# EAGLE design Ad8232_placa_V4 (EAGLE 9.6.2)
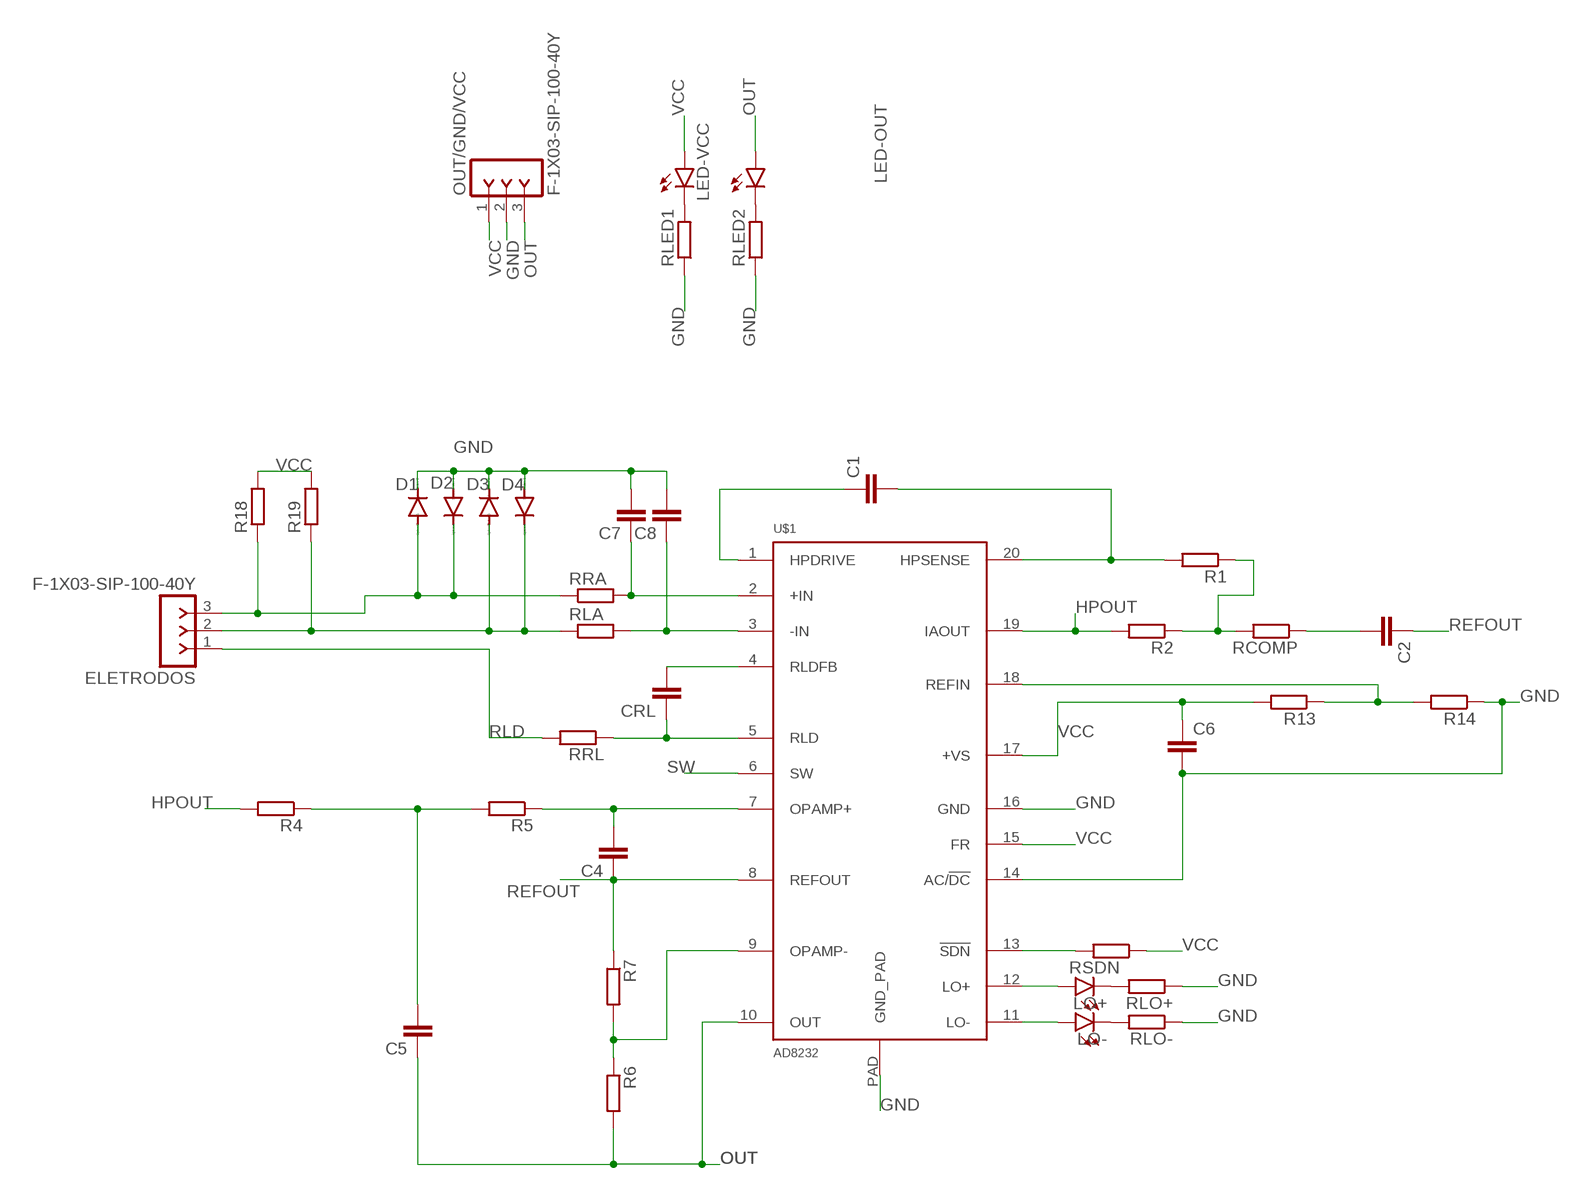
[diagram p0: schematic, sheet 1]

## Parts
C1  C-EUC0805  [C0805]
C2  C-EUC0805  [C0805]
C4  C-EUC0805  [C0805]
C5  C-EUC0805  [C0805]
C6  C-EUC0805  [C0805]
C7  C-EUC0805  [C0805]
C8  C-EUC0805  [C0805]
CRL  C-EUC0805  [C0805]
D1  DIODE-MINIMELF  [MINIMELF]
D2  DIODE-MINIMELF  [MINIMELF]
D3  DIODE-MINIMELF  [MINIMELF]
D4  DIODE-MINIMELF  [MINIMELF]
ELETRODOS  F-1X03-SIP-100-40Y  [SIP-100-03-40Y]
LED-OUT  LEDCHIPLED_0603  [CHIPLED_0603]
LED-VCC  LEDCHIPLED_0603  [CHIPLED_0603]
LO+  LEDCHIPLED_0603  [CHIPLED_0603]
LO-  LEDCHIPLED_0603  [CHIPLED_0603]
OUT/GND/VCC  F-1X03-SIP-100-40Y  [SIP-100-03-40Y]
R1  R-EU_R0805  [R0805]
R2  R-EU_R0805  [R0805]
R4  R-EU_R0805  [R0805]
R5  R-EU_R0805  [R0805]
R6  R-EU_R0805  [R0805]
R7  R-EU_R0805  [R0805]
R13  R-EU_R0805  [R0805]
R14  R-EU_R0805  [R0805]
R18  R-EU_R0805  [R0805]
R19  R-EU_R0805  [R0805]
RCOMP  R-EU_R0805  [R0805]
RLA  R-EU_R0805  [R0805]
RLED1  R-EU_R0805  [R0805]
RLED2  R-EU_R0805  [R0805]
RLO+  R-EU_R0805  [R0805]
RLO-  R-EU_R0805  [R0805]
RRA  R-EU_R0805  [R0805]
RRL  R-EU_R0805  [R0805]
RSDN  R-EU_R0805  [R0805]
U$1  AD8232  [LFCSP_20]

## Nets
GND: C6.2 C7.2 C8.2 D1.C D2.A D3.C D4.A OUT/GND/VCC.2 R14.1 RLED1.1 RLED2.1 RLO+.1 RLO-.1 U$1.14(AC/!DC) U$1.16(GND) U$1.PAD(GND_PAD)
HPOUT: R2.2 R4.2 U$1.19(IAOUT)
LO+: LO+.A U$1.12(LO+)
LO-: LO-.A U$1.11(LO-)
N$1: C1.1 U$1.1(HPDRIVE)
N$2: C1.2 R1.2 U$1.20(HPSENSE)
N$3: C7.1 RRA.2 U$1.2(+IN)
N$4: C8.1 RLA.2 U$1.3(-IN)
N$5: D1.A D2.C ELETRODOS.3 R18.1 RRA.1
N$6: D3.A D4.C ELETRODOS.2 R19.1 RLA.1
N$7: CRL.2 U$1.4(RLDFB)
N$8: CRL.1 RRL.1 U$1.5(RLD)
N$9: C4.2 R5.1 U$1.7(OPAMP+)
N$10: R13.1 R14.2 U$1.18(REFIN)
N$11: R6.1 R7.2 U$1.9(OPAMP-)
N$12: LED-OUT.C RLED2.2
N$13: R1.1 R2.1 RCOMP.2
N$14: C5.2 R4.1 R5.2
N$15: LED-VCC.C RLED1.2
N$16: RSDN.2 U$1.13(!SDN)
N$17: LO+.C RLO+.2
N$18: LO-.C RLO-.2
OUT: C5.1 LED-OUT.A OUT/GND/VCC.3 R6.2 U$1.10(OUT)
REFOUT: C2.1 C4.1 R7.1 U$1.8(REFOUT)
RLD: ELETRODOS.1 RRL.2
SW: C2.2 RCOMP.1 U$1.6(SW)
VCC: C6.1 LED-VCC.A OUT/GND/VCC.1 R13.2 R18.2 R19.2 RSDN.1 U$1.15(FR) U$1.17(+VS)

## Library data of the parts
C1 C2 C4-C8 CRL = rcl:C-EU: CAPACITOR, European symbol
D1-D4 = diode:DIODE-: DIODE
ELETRODOS OUT/GND/VCC = con-headers-jp:F-1X03-: FEMALE HEADER
LED-OUT LED-VCC LO+ LO- = led:LED: LED OSRAM: - CHIPLED LG R971, LG N971, LY N971, LG Q971, LY Q971, LO R971, LY R971 LH N974, LH R974 LS Q976, LO Q976, LY Q976 LO Q996 - Hyper CHIPLED LW Q18S LB Q993, LB Q99A, LB R99A - SideLED LS A670, LO A670, LY A670, LG A670, LP A670 LB A673, LV A673, LT A673, LW A673 LH A674 LY A675 LS A676, LA A676, LO A676, LY A676, LW A676 LS A679, LY A679, LG A679 - Hyper Micro SIDELED® LS Y876, LA Y876, LO Y876, LY Y876 LT Y87S - SmartLED LW L88C, LW L88S LB L89C, LB L89S, LG L890 LS L89K, LO L89K, LY L89K LS L896, LA L896, LO L896, LY L896 - TOPLED LS T670, LO T670, LY T670, LG T670, LP T670 LSG T670, LSP T670, LSY T670, LOP T670, LYG T670 LG T671, LOG T671, LSG T671 LB T673, LV T673, LT T673, LW T673 LH T674 LS T676, LA T676, LO T676, LY T676, LB T676, LH T676, LSB T676, LW T676 LB T67C, LV T67C, LT T67C, LS T67K, LO T67K, LY T67K, LW E67C LS E67B, LA E67B, LO E67B, LY E67B, LB E67C, LV E67C, LT E67C LW T67C LS T679, LY T679, LG T679 LS T770, LO T770, LY T770, LG T770, LP T770 LB T773, LV T773, LT T773, LW T773 LH T774 LS E675, LA E675, LY E675, LS T675 LS T776, LA T776, LO T776, LY T776, LB T776 LHGB T686 LT T68C, LB T68C - Hyper Mini TOPLED® LB M676 - Mini TOPLED Santana® LG M470 LS M47K, LO M47K, LY M47K Source: http://www.osram.convergy.de LUXEON: - LUMILED® LXK2-PW12-R00, LXK2-PW12-S00, LXK2-PW14-U00, LXK2-PW14-V00 LXK2-PM12-R00, LXK2-PM12-S00, LXK2-PM14-U00 LXK2-PE12-Q00, LXK2-PE12-R00, LXK2-PE12-S00, LXK2-PE14-T00, LXK2-PE14-U00 LXK2-PB12-K00, LXK2-PB12-L00, LXK2-PB12-M00, LXK2-PB14-N00, LXK2-PB14-P00, LXK2-PB14-Q00 LXK2-PR12-L00, LXK2-PR12-M00, LXK2-PR14-Q00, LXK2-PR14-R00 LXK2-PD12-Q00, LXK2-PD12-R00, LXK2-PD12-S00 LXK2-PH12-R00, LXK2-PH12-S00 LXK2-PL12-P00, LXK2-PL12-Q00, LXK2-PL12-R00 Source: www.luxeon.com KINGBRIGHT: KA-3528ASYC Source: www.kingbright.com
R1 R2 R4-R7 R13 R14 R18 R19 RCOMP RLA RLED1 RLED2 RLO+ RLO- RRA RRL RSDN = rcl:R-EU_: RESISTOR, European symbol
U$1 = AD8232:AD8232: Check prices <https://pricing.snapeda.com/parts/AD8232/Analog%20Devices/view-part?ref=eda>; AVAILABILITY: Not in stock; DESCRIPTION: AD8232 Sensor Signal Conditioner Interface Evaluation Board; MF: Analog Devices; MP: AD8232; PACKAGE: LFCSP-20 Analog Devices; PRICE: None

## Board
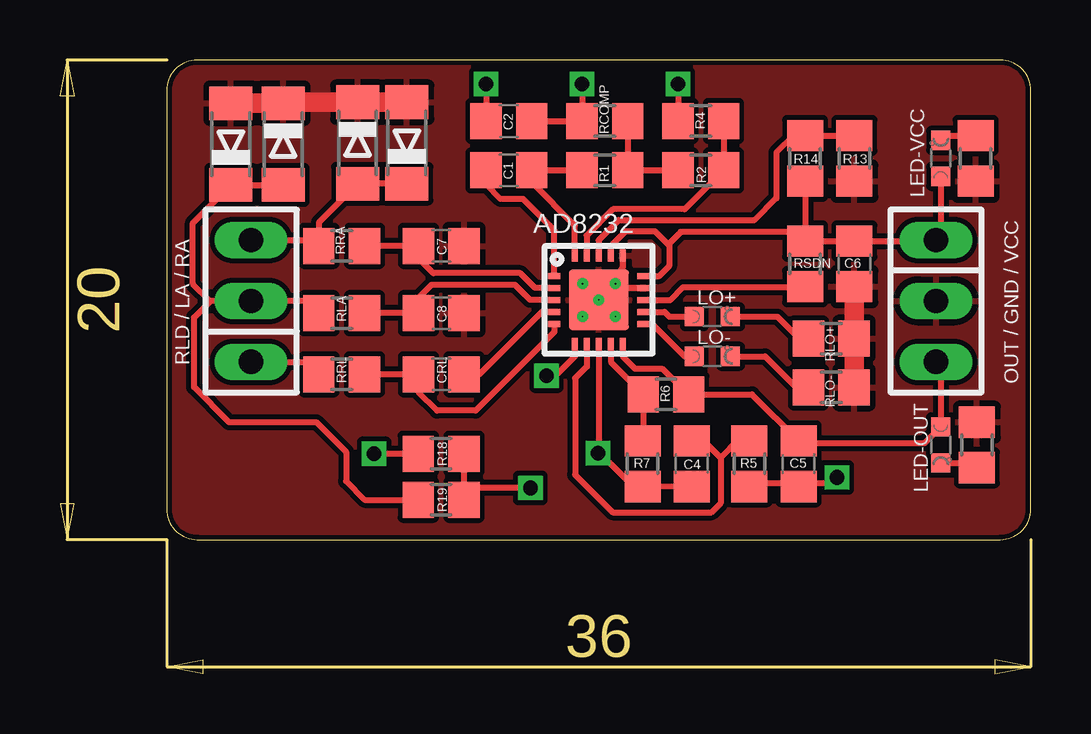
[diagram p1: board, top side]
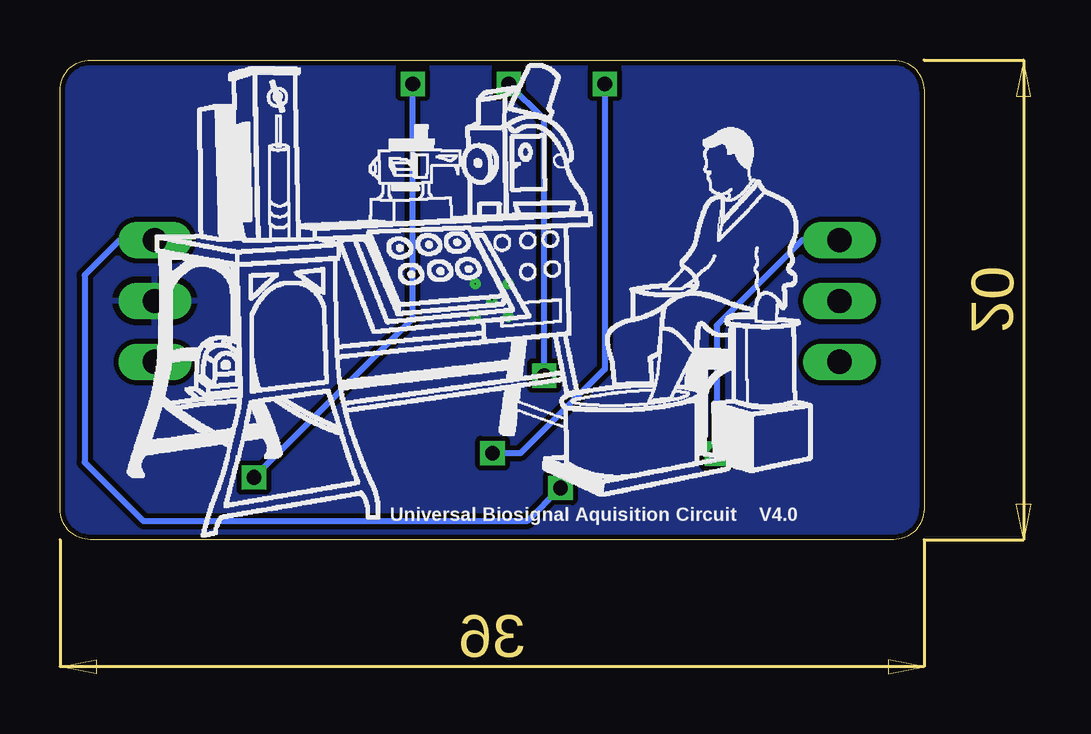
[diagram p2: board, bottom side, seen from below]

Size 36 x 20 mm. Coordinates in mm from the lower left corner, seen from the top.
Outline: 0,18.73 0,1.27 arc90 1.27,0 34.73,0 arc90 36,1.27 36,18.73 arc90 34.73,20 1.27,20 arc90 0,18.73
Copper layers (1*16): Top 0.035mm / dielectric 1.5mm / Bottom 0.035mm
Design rules "default *": minimum track width 10mil, minimum drill 24mil, track to track 8mil, track to pad 8mil, pad to pad 8mil, via to via 8mil, smd to smd 8mil, copper to edge 8mil, drill to drill 8mil, minimum pad ring 10mil, minimum via ring 8mil, stop-mask expansion 4mil, vias tented up to drill 0mil, thermal gap 10mil

### Footprints (pad centres in the part's own frame; a part is rotated, then mirrored left to right if it is on the bottom)
C0805 = smd 1.3 x 1.5: 1 -0.95,0; 2 0.95,0
MINIMELF = smd 1.4 x 1.8: A 1.7,0; C -1.7,0
SIP-100-03-40Y = drill 1.016 long: 1 -2.54,0; 2 0,0; 3 2.54,0
CHIPLED_0603 = smd 0.8 x 0.8: A 0,-0.75; C 0,0.75
R0805 = smd 1.3 x 1.5: 1 -0.95,0; 2 0.95,0
LFCSP_20 = smd 0.5 x 0.25: 1 -1.85,1; 2 -1.85,0.5; 3 -1.85,0; 4 -1.85,-0.5; 5 -1.85,-1; 11 1.85,-1; 12 1.85,-0.5; 13 1.85,0; 14 1.85,0.5; 15 1.85,1 | smd 0.25 x 0.5: 6 -1,-1.85; 7 -0.5,-1.85; 8 0,-1.85; 9 0.5,-1.85; 10 1,-1.85; 16 1,1.85; 17 0.5,1.85; 18 0,1.85; 19 -0.5,1.85; 20 -1,1.85 | smd 2.5 x 2.5: PAD 0,0

### Placement (x,y rotation side)
C1  14.25,15.4 0 top
C2  14.25,17.45 0 top
C4  21.87,3.16 90 top
C5  26.32,3.16 270 top
C6  28.65,11.5 270 top
C7  11.43,12.25 0 top
C8  11.43,9.44 0 top
CRL  11.43,6.89 0 top
D1  7.95,16.54 270 top
D2  10,16.54 90 top
D3  4.85,16.49 270 top
D4  2.67,16.49 90 top
ELETRODOS  3.51,9.95 90 top
LED-OUT  32.25,3.95 180 top
LED-VCC  32.25,15.9 0 top
LO+  22.73,9.3 270 top
LO-  22.73,7.65 270 top
OUT/GND/VCC  32.05,9.95 270 top
R1  18.25,15.4 180 top
R2  22.25,15.4 0 top
R4  22.25,17.45 0 top
R5  24.27,3.16 270 top
R6  20.8,6.05 0 top
R7  19.82,3.16 90 top
R13  26.6,15.9 270 top
R14  28.65,15.9 90 top
R18  11.43,3.58 0 top
R19  11.43,1.66 0 top
RCOMP  18.25,17.45 0 top
RLA  7.29,9.44 0 top
RLED1  33.7,15.9 90 top
RLED2  33.75,3.95 270 top
RLO+  27.69,8.38 180 top
RLO-  27.69,6.35 180 top
RRA  7.29,12.25 0 top
RRL  7.29,6.89 180 top
RSDN  26.6,11.5 270 top
U$1  18,10 0 top

### Tracks (layer width: path | path; a pad name or v marks a point on that pad's centre or on a via)
GND  (via drill 0.05 pad 0.05)
  Top 0.254: C7.2 12.38,11.65 | C8.2 12.38,9.99 | U$1.14 18.5,10.5 U$1.PAD 18.38,10.38 19,11.38 U$1.16 | 28.65,8.4 RLO+.1 | D3.C 4.9,18.24
  Top 0.813: C6.2 28.65,8.4 | RLO+.1 RLO-.1 | D2.A D1.C 4.9,18.24 | D3.C D4.A
  other vias: 18.69,9.3 17.32,9.3 17.32,10.67 18.69,10.67 18,10
  pour Top: -0.3,20.35 36.35,20.35 36.35,-0.48 -0.3,-0.48
  pour Bottom: -1.52,22.65 -1.52,-1.63 37.9,-1.63 37.9,22.65
HPOUT
  Top 0.254: R4.2 R2.2 21.58,13.78 18.59,13.78 17.5,12.69 U$1.19
LO+
  Top 0.254: U$1.12 20.74,9.5 20.94,9.3 LO+.A
LO-
  Top 0.254: U$1.11 20.22,9 21.58,7.64 LO-.A
N$1
  Top 0.254: U$1.1 16.15,12.9 14.85,14.2 13.9,14.2 13.3,14.8 C1.1
N$2
  Top 0.254: R1.2 C1.2 15.2,14.9 17,13.1 U$1.20
N$3
  Top 0.254: RRA.2 C7.1 10.48,11.74 11.11,11.11 14.73,11.11 15.35,10.5 U$1.2
N$4
  Top 0.254: RLA.2 C8.1 10.48,10.08 11.02,10.62 14.52,10.62 15.13,10 U$1.3
N$5  (via drill 0.61 pad 0.05)
  Top 0.254: D2.C D1.A | D1.A 7.5,14.39 | D1.A 6.34,13.22 RRA.1 6.2,12.38 6.2,12.46 3.49,12.46 ELETRODOS.3 | R18.1 v8.64,3.58
  Bottom 0.254: ELETRODOS.3 5.06,12.49 8.64,8.92 v8.64,3.58
N$6
  Top 0.254: RLA.1 5.83,9.95 ELETRODOS.2 | D3.A D4.C 1.08,13.21 1.08,10.66 1.8,9.95 ELETRODOS.2 | ELETRODOS.2 1.82,9.95 1.14,9.26 1.14,6.36 2.59,4.9 6.22,4.9 7.47,3.66 7.47,2.44 8.24,1.66 R19.1
N$7
  Top 0.254: CRL.2 13.02,6.89 15.62,9.5 U$1.4
N$8
  Top 0.254: U$1.5 16.15,8.66 12.87,5.38 11.27,5.38 10.48,6.16 CRL.1 RRL.1
N$9
  Top 0.254: C4.2 22.37,4.11 23.07,3.41 | 23.07,3.41 23.07,1.51 22.7,1.14 18.58,1.14 17.02,2.7 17.02,6.73 17.5,7.21 U$1.7 | R5.1 23.77,4.11 23.07,3.41
N$10
  Top 0.254: R14.2 R13.1 26.1,16.85 25.4,16.15 25.4,14.23 24.49,13.32 18.83,13.32 18,12.49 U$1.18
N$11
  Top 0.254: 19.7,4.11 R7.2 19.85,4.14 R6.1 18.5,7.41 U$1.9
N$12
  Top 0.254: LED-OUT.C 33.55,3.2 RLED2.2
N$13
  Top 0.254: RCOMP.2 R1.1 R2.1
N$14  (via drill 0.61)
  Top 0.254: R5.2 24.4,2.34 26.2,2.34 C5.2 26.45,2.34 27.67,2.34 v27.92,2.59 | v21.3,19 R4.1
  Bottom 0.254: v27.92,2.59 21.3,9.21 v21.3,19
N$15
  Top 0.254: LED-VCC.C 32.45,16.85 RLED1.2
N$16
  Top 0.254: U$1.13 20.99,10 21.51,10.51 26.77,10.51 26.81,10.55 RSDN.2
N$17
  Top 0.254: LO+.C 25.44,9.3 26.36,8.38 RLO+.2
N$18
  Top 0.254: LO-.C 24.93,7.64 26.23,6.35 RLO-.2
OUT
  Top 0.254: OUT/GND/VCC.3 32.25,7.28 LED-OUT.A 31.56,4.01 26.42,4.01 C5.1 24.38,6.05 R6.2 21.72,6.05 20.64,7.13 19.51,7.13 19,7.64 U$1.10
REFOUT  (via drill 0.61)
  Top 0.254: C4.1 19.86,2.19 R7.1 19.44,2.21 18.04,3.61 v17.97,3.61 18,3.64 U$1.8 | v13.3,19 C2.1
  Bottom 0.254: v17.97,3.61 16.8,3.61 13.3,7.11 v13.3,19
RLD
  Top 0.254: ELETRODOS.1 5.82,7.41 RRL.2
SW  (via drill 0.61)
  Top 0.254: C2.2 RCOMP.1 v17.3,19 | U$1.6 17,7.64 16.2,6.84 v15.82,6.84
  Bottom 0.254: v15.82,6.84 15.82,17.52 v17.3,19
VCC  (via drill 0.61 pad 0.05)
  Top 0.254: R13.2 RSDN.1 | RSDN.1 C6.1 32.01,12.45 OUT/GND/VCC.1 32.25,12.69 LED-VCC.A | U$1.17 18.5,12.25 19.1,12.85 20.35,12.85 20.91,12.29 20.93,12.31 | U$1.15 20.52,11 20.93,11.4 20.93,12.31 | RSDN.1 26.22,12.83 21.41,12.83 20.93,12.35 20.93,12.31 | v15.15,2.15 12.87,2.15 R19.2 R18.2
  Bottom 0.254: OUT/GND/VCC.1 33.51,12.49 34.97,11.03 34.97,3.22 32.51,0.76 16.54,0.76 v15.15,2.15

### Text on the board
bPlace: Universal Biosignal Aquisition Circuit V4.0
tNames: RLD / LA / RA | OUT / GND / VCC
_tNames: C5 | R12 | R7 | R14 | R13 | C1 | R11 | R10 | LED-VCC | R1 | C7 | R15 | C6 | LO+ | R2 | C8 | R16 | LO- | R5 | C2 | R17 | R9 | R18 | R8 | C3 | R6 | C4 | LED-OUT | R19